# Altium schematic sheet ANALOG_HC_OVERCURRENT_REDUNDANCY_CCT.SchDoc
size A
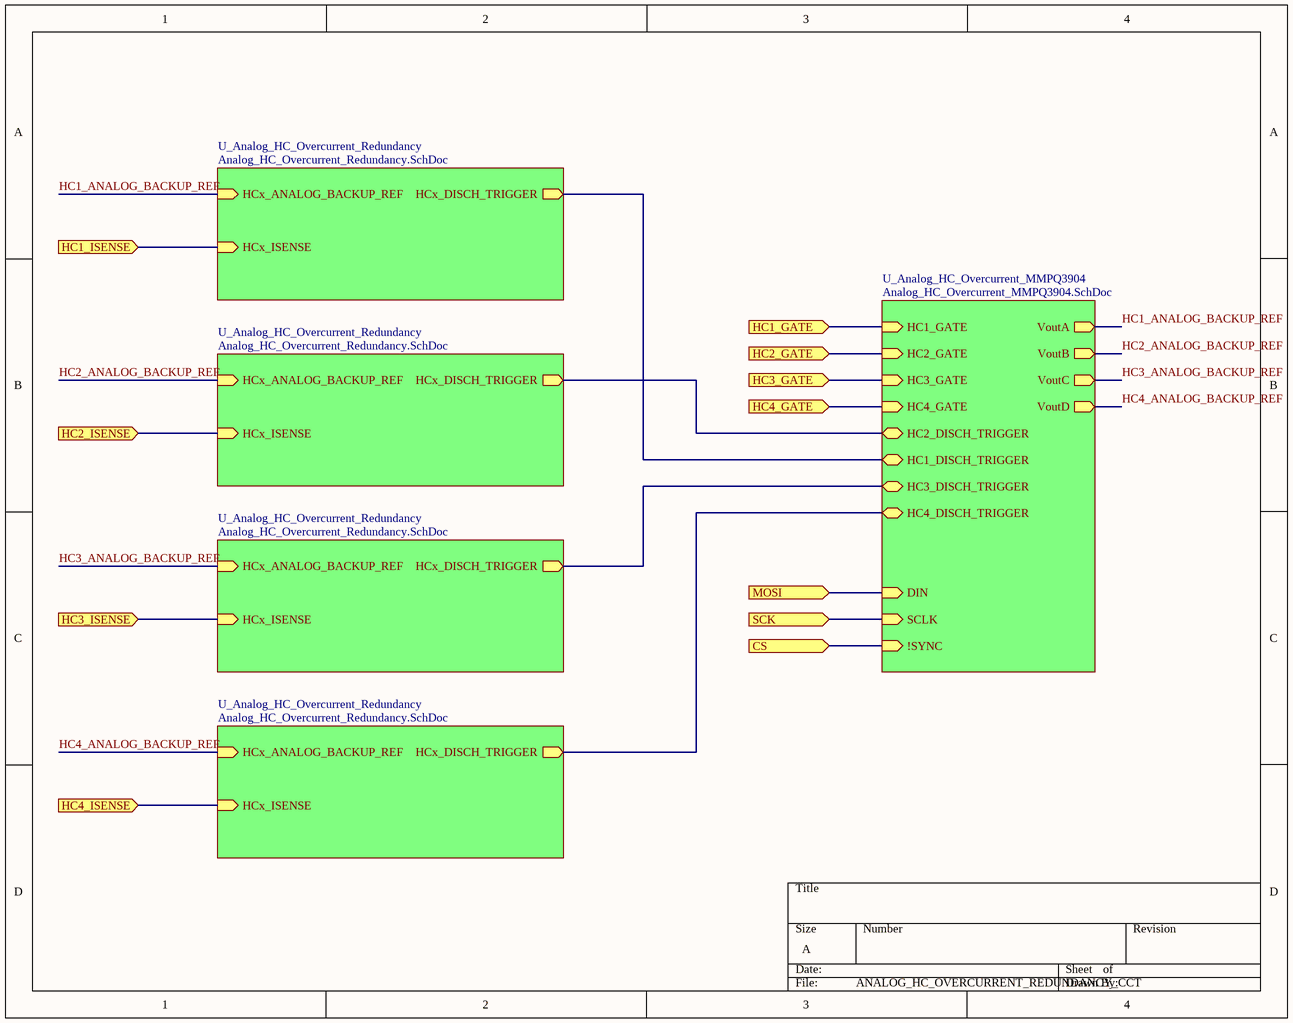
[diagram p0: ANALOG_HC_OVERCURRENT_REDUNDANCY_CCT.SchDoc]

## Sub-sheets
U_Analog_HC_Overcurrent_MMPQ3904 = Analog_HC_Overcurrent_MMPQ3904.SchDoc: HC1_GATE (in), HC2_GATE (in), HC3_GATE (in), HC4_GATE (in), HC2_DISCH_TRIGGER (bidir), HC1_DISCH_TRIGGER (bidir), HC3_DISCH_TRIGGER (bidir), HC4_DISCH_TRIGGER (bidir), VoutA (out), VoutB (out), VoutC (out), VoutD (out), DIN (in), SCLK (in), !SYNC (in)
U_Analog_HC_Overcurrent_Redundancy = Analog_HC_Overcurrent_Redundancy.SchDoc: HCx_DISCH_TRIGGER (out), HCx_ANALOG_BACKUP_REF (in), HCx_ISENSE (in)
U_Analog_HC_Overcurrent_Redundancy = Analog_HC_Overcurrent_Redundancy.SchDoc: HCx_DISCH_TRIGGER (out), HCx_ANALOG_BACKUP_REF (in), HCx_ISENSE (in)
U_Analog_HC_Overcurrent_Redundancy = Analog_HC_Overcurrent_Redundancy.SchDoc: HCx_DISCH_TRIGGER (out), HCx_ANALOG_BACKUP_REF (in), HCx_ISENSE (in)
U_Analog_HC_Overcurrent_Redundancy = Analog_HC_Overcurrent_Redundancy.SchDoc: HCx_DISCH_TRIGGER (out), HCx_ANALOG_BACKUP_REF (in), HCx_ISENSE (in)

## Ports
CS (in), HC1_GATE (in), HC1_ISENSE (in), HC2_GATE (in), HC2_ISENSE (in), HC3_GATE (in), HC3_ISENSE (in), HC4_GATE (in), HC4_ISENSE (in), MOSI (in), SCK (in)

## Nets
CS: port CS, sheet U_Analog_HC_Overcurrent_MMPQ3904/!SYNC
HC1_ANALOG_BACKUP_REF: sheet U_Analog_HC_Overcurrent_Redundancy/HCx_ANALOG_BACKUP_REF, sheet U_Analog_HC_Overcurrent_MMPQ3904/VoutA
HC1_GATE: port HC1_GATE, sheet U_Analog_HC_Overcurrent_MMPQ3904/HC1_GATE
HC1_ISENSE: port HC1_ISENSE, sheet U_Analog_HC_Overcurrent_Redundancy/HCx_ISENSE
HC2_ANALOG_BACKUP_REF: sheet U_Analog_HC_Overcurrent_Redundancy/HCx_ANALOG_BACKUP_REF, sheet U_Analog_HC_Overcurrent_MMPQ3904/VoutB
HC2_GATE: port HC2_GATE, sheet U_Analog_HC_Overcurrent_MMPQ3904/HC2_GATE
HC2_ISENSE: port HC2_ISENSE, sheet U_Analog_HC_Overcurrent_Redundancy/HCx_ISENSE
HC3_ANALOG_BACKUP_REF: sheet U_Analog_HC_Overcurrent_Redundancy/HCx_ANALOG_BACKUP_REF, sheet U_Analog_HC_Overcurrent_MMPQ3904/VoutC
HC3_GATE: port HC3_GATE, sheet U_Analog_HC_Overcurrent_MMPQ3904/HC3_GATE
HC3_ISENSE: port HC3_ISENSE, sheet U_Analog_HC_Overcurrent_Redundancy/HCx_ISENSE
HC4_ANALOG_BACKUP_REF: sheet U_Analog_HC_Overcurrent_Redundancy/HCx_ANALOG_BACKUP_REF, sheet U_Analog_HC_Overcurrent_MMPQ3904/VoutD
HC4_GATE: port HC4_GATE, sheet U_Analog_HC_Overcurrent_MMPQ3904/HC4_GATE
HC4_ISENSE: port HC4_ISENSE, sheet U_Analog_HC_Overcurrent_Redundancy/HCx_ISENSE
MOSI: port MOSI, sheet U_Analog_HC_Overcurrent_MMPQ3904/DIN
SCK: port SCK, sheet U_Analog_HC_Overcurrent_MMPQ3904/SCLK
(unnamed): sheet U_Analog_HC_Overcurrent_Redundancy/HCx_DISCH_TRIGGER, sheet U_Analog_HC_Overcurrent_MMPQ3904/HC1_DISCH_TRIGGER
(unnamed): sheet U_Analog_HC_Overcurrent_Redundancy/HCx_DISCH_TRIGGER, sheet U_Analog_HC_Overcurrent_MMPQ3904/HC2_DISCH_TRIGGER
(unnamed): sheet U_Analog_HC_Overcurrent_Redundancy/HCx_DISCH_TRIGGER, sheet U_Analog_HC_Overcurrent_MMPQ3904/HC3_DISCH_TRIGGER
(unnamed): sheet U_Analog_HC_Overcurrent_Redundancy/HCx_DISCH_TRIGGER, sheet U_Analog_HC_Overcurrent_MMPQ3904/HC4_DISCH_TRIGGER